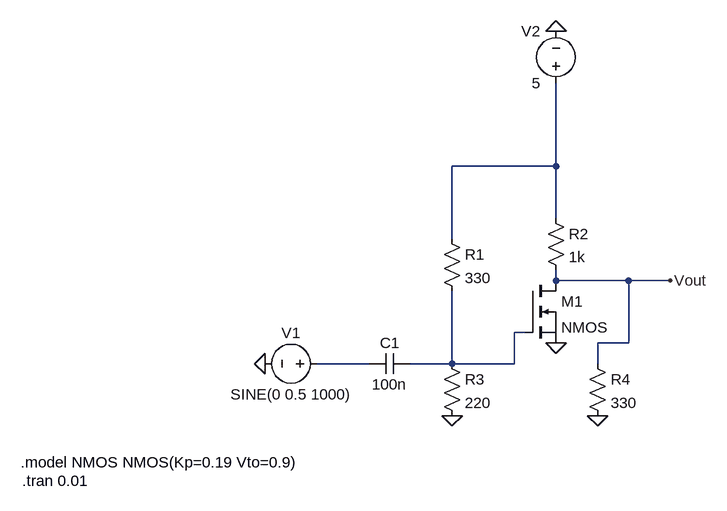
[diagram p0: schematic D5-DÇ2.asc]
D5-DÇ2.asc, the LTspice schematic file:
Version 4
SHEET 1 880 680
WIRE 592 -80 592 -208
WIRE 592 -80 432 -80
WIRE 592 0 592 -80
WIRE 432 32 432 -80
WIRE 592 96 592 80
WIRE 704 96 592 96
WIRE 768 96 704 96
WIRE 544 176 528 176
WIRE 704 192 704 96
WIRE 704 192 656 192
WIRE 304 224 224 224
WIRE 432 224 432 112
WIRE 432 224 368 224
WIRE 528 224 528 176
WIRE 528 224 432 224
WIRE 656 224 656 192
FLAG 432 304 0
FLAG 592 192 0
FLAG 656 304 0
FLAG 144 224 0
FLAG 592 -288 0
FLAG 768 96 Vout
SYMBOL res 416 16 R0
SYMATTR InstName R1
SYMATTR Value 330
SYMBOL res 576 -16 R0
SYMATTR InstName R2
SYMATTR Value 1k
SYMBOL res 416 208 R0
SYMATTR InstName R3
SYMATTR Value 220
SYMBOL res 640 208 R0
SYMATTR InstName R4
SYMATTR Value 330
SYMBOL nmos 544 96 R0
SYMATTR InstName M1
SYMBOL cap 368 208 R90
WINDOW 0 0 32 VBottom 2
WINDOW 3 32 32 VTop 2
SYMATTR InstName C1
SYMATTR Value 100n
SYMBOL voltage 240 224 R90
WINDOW 0 -32 56 VBottom 2
WINDOW 3 32 56 VTop 2
WINDOW 123 0 0 Left 0
WINDOW 39 0 0 Left 0
SYMATTR InstName V1
SYMATTR Value SINE(0 0.5 1000)
SYMBOL voltage 592 -192 R180
WINDOW 0 24 96 Left 2
WINDOW 3 24 16 Left 2
WINDOW 123 0 0 Left 0
WINDOW 39 0 0 Left 0
SYMATTR InstName V2
SYMATTR Value 5
TEXT -232 376 Left 2 !.model NMOS NMOS(Kp=0.19 Vto=0.9)
TEXT -230 404 Left 2 !.tran 0.01

The netlist it stands for:
* D5-DÇ2.asc
R1 N001 N002 330
R2 N001 Vout 1k
R3 N002 0 220
R4 Vout 0 330
M1 Vout N002 0 0 NMOS
C1 N002 N003 100n
V1 N003 0 SINE(0 0.5 1000)
V2 N001 0 5
.model NMOS NMOS
.model PMOS PMOS
.lib standard.mos
.model NMOS NMOS(Kp=0.19 Vto=0.9)
.tran 0.01
.backanno
.end